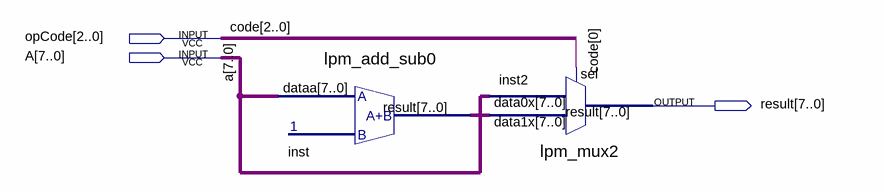
[diagram p0: schematic sheet]
// Quartus schematic ALU_LOG.bdf as structural Verilog: 2 symbols, 3 pins
module ALU_LOG (
  input  [2:0] opCode,
  input  [7:0] A,
  output [7:0] result
);

  wire [7:0] inst_result;

  lpm_add_sub0 inst (.dataa(A), .result(inst_result));
  lpm_mux2 inst2 (.data1x(inst_result), .data0x(A), .sel(opCode[0]), .result(result));

  // Other names for the same wires on the sheet: code[2:0] = opCode
endmodule
